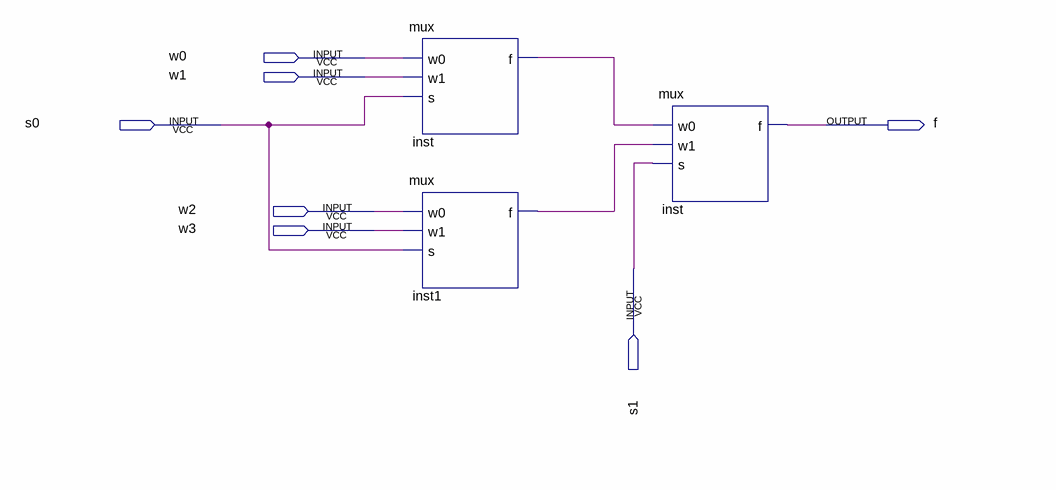
[diagram p0: schematic sheet]
// Quartus schematic muxModified.bdf as structural Verilog: 3 symbols, 7 pins
module muxModified (
  input  w0,
  input  w1,
  input  s0,
  input  w2,
  input  w3,
  input  s1,
  output f
);

  wire inst1_f, inst_f;

  mux inst (.w0(w0), .w1(w1), .s(s0), .f(inst_f));
  mux inst1 (.w0(w2), .w1(w3), .s(s0), .f(inst1_f));
  mux inst_dup2 (.w0(inst_f), .w1(inst1_f), .s(s1), .f(f));
endmodule
